# Altium schematic sheet AMS1117-3.3.schdoc
size 127 x 101 mm
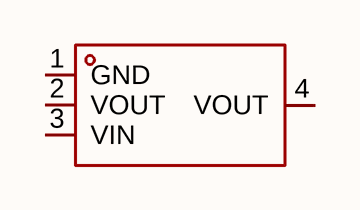
[diagram p0: AMS1117-3.3.schdoc]

## Parts
U?  ams1117-3.3_c6186  [SOT-223-3_L6.5-W3.4-P2.30-LS7.0-BR]  (value not drawn)

## Nets

Not connected (* = marked no-connect by the designer): U? 1(GND) 2(VOUT) 3(VIN) 4(VOUT)

## Library data of the parts
U? = ams1117-3.3_c6186: 输出极性:正极;工作电压:15V;输出电压:3.3V;输出电流:1A;电源纹波抑制比(PSRR):72dB@(120Hz);输出类型:固定;; Manufacturer: Advanced Monolithic Systems; AddInBom: yes; ModelId: 925194bf9823436183a3e0b978a8d076; ModelName: SOT-223-4P_L6.5-W3.5-H1.6-LS7.0-P2.30; ModelTransform: 279.89794,255.905,0,180,0,0,-3.9385,-0.0005,0; Output Configuration: 正极; Voltage - Supply: 15V; Output Voltage: 3.3V; Output Current: 1A; Voltage Dropout: 1.1V@(800mA); standby current: 5mA; Noise: 0.003%Vout; Output Type: 固定; Number of Outputs: 1; LCSC Part Name: 3.3V 1A 15V; SupplierPart: C6186; ManufacturerPart: AMS1117-3.3; Supplier Footprint: SOT-223; JLCPCB Part Class: Basic Part; Datasheet: https://item.szlcsc.com/datasheet/AMS1117-3.3/6652.html; Supplier: LCSC; ConvertToPcb: yes; SymbolName: AMS1117-3.3; FootprintName: SOT-223-3_L6.5-W3.4-P2.30-LS7.0-BR; Power Supply Rejection Ratio (PSRR): 72dB@(120Hz); Features: 短路保护；热关断；过流保护; Operating Temperature: -40℃~+125℃